# EasyEDA Pro project ProPrj_SlimeVR_RelicSkin（fork from SK）.epro, board Relic_BNO085
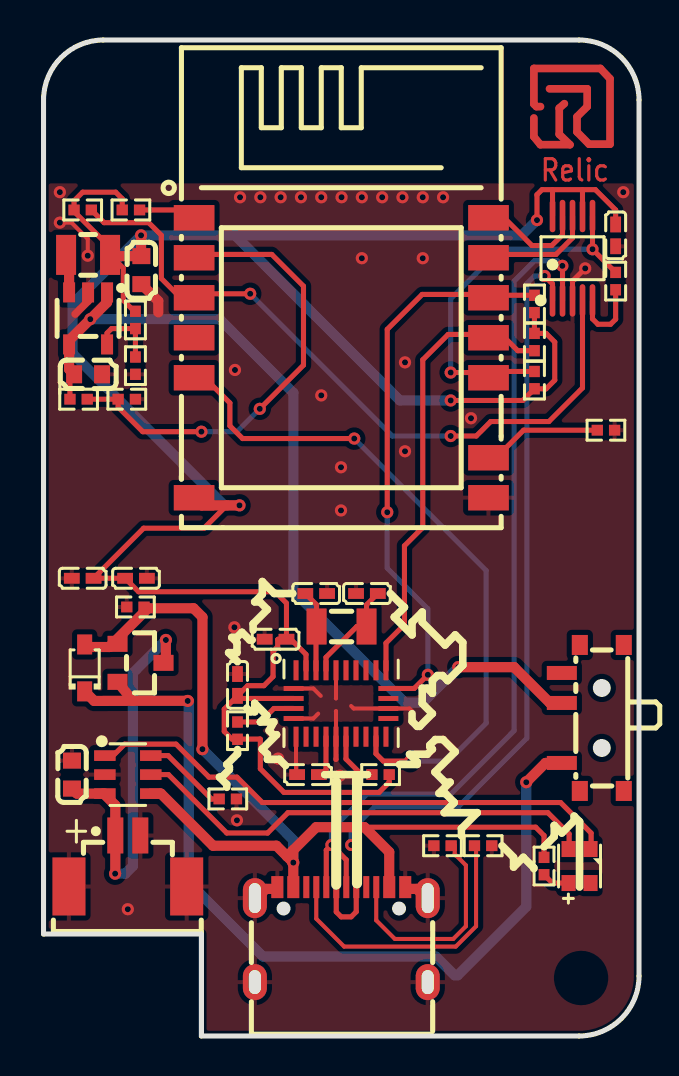
[diagram p7: board, top side]
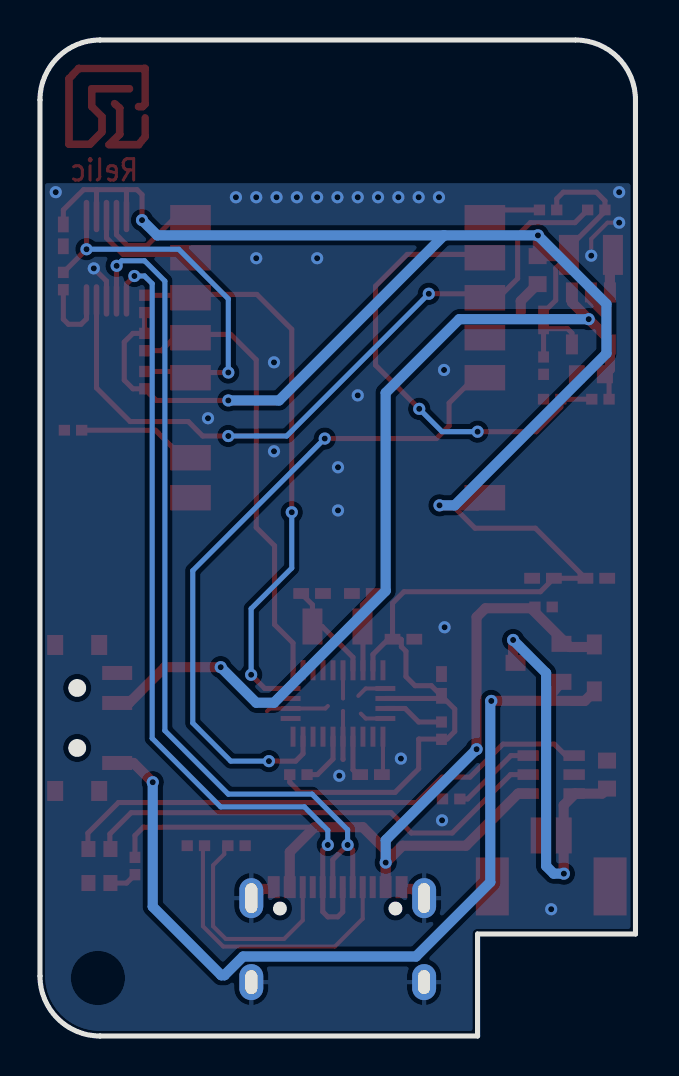
[diagram p8: board, bottom side, seen from below]

Outline 29.8 x 49.8 mm; copper layers: Top Layer, Bottom Layer. Coordinates in mm from the lower left corner of the outline.
Outline path: 0,46.8 arc(0.88,48.92) 3,49.8 26.8,49.8 arc(28.92,48.92) 29.8,46.8 29.8,3 arc(28.92,0.88) 26.8,0 7.9,0 7.9,5.1 0,5.1 0,46.8
Stack: Top Layer 0.035mm / Dielectric1 0.91mm FR4 er 4.5 / Bottom Layer 0.035mm

## Design rules (mm)
spacing Default (default): track to track 0.127, other pairs 0 to 0.127
track width Default (default): min 0.127, default 0.127, max 25.4
differential pair differentialPair (default): width min 0.127, default 0.254, max 2.54; gap min 0.152, default 0.152
via Default (default): diameter min 0.61, default 0.61, max 100.025; hole min 0.305, default 0.305, max 59.995
net GND uses gge20888(1)

## Placement (name value [footprint] x y rotation side)
BNO085  BNO080  [bno080]  14.89 16.63 90 top
C1  1uF  [C0402]  1.96 22.89 0 top
C2  100nF  [C0402]  4.63 22.89 180 top
C3  100nF  [C0402]  28.63 40.03 90 top
C4  10uF  [C0603]  2.23 33.09 180 top
C5  10uF  [C0603]  4.9 38.29 90 top
C6  22pF  [C0402]  13.64 22.12 180 top
C7  22pF  [C0402]  16.18 22.12 0 top
C8  100nF  [C0402]  13.24 13.07 180 top
C9  100nF  [C0402]  9.71 17.55 270 top
C10  100nF  [C0402]  11.61 19.84 0 top
CN1  1.25-2PWB  [conn-smd_2p-p1.25_dealon_1.25-2pwb]  4.22 8.75 0 top
CP1  10uF  [C0603]  1.42 13.07 270 top
D1  1N5819WS  [SOD-323_L1.8-W1.3-LS2.5-RD]  2.06 18.4 90 top
ESP1  2.4GHz  [wifim-smd_esp-12f-esp8266mod]  14.9 33.26 270 top
FB1  22kΩ  [R0402]  4.6 33.52 90 top
FB2  100kΩ  [R0402]  4.6 35.8 90 top
L1  2.2uH  [IND-SMD_L2.5-W2.0_YXMBL252010P]  2.23 39.06 180 top
LED1  NH-B2020RGBA-HF  [LED-ARRAY-SMD_4P-L2.1-W2.1-TL_NH-B2020RGBA]  26.82 8.5 270 top
P1  TP4057-42-SOT26-R  [SOT-23-6_L2.9-W1.6-P0.95-LS2.8-BL]  4.22 13.07 270 top
Q1  AO3401A  [SOT-23_L2.9-W1.3-P1.90-LS2.4-BR]  4.85 18.66 180 top
R1  4.7kΩ  [R0402]  1.96 41.3 0 top
R2  4.7kΩ  [R0402]  4.37 41.3 0 top
R3  4.7kΩ  [R0402]  24.57 32.79 90 top
R4  4.7kΩ  [R0402]  24.57 34.7 270 top
R5  4.7kΩ  [R0402]  24.57 36.6 90 top
R6  10kΩ  [R0402]  9.71 15.27 90 top
R7  4.7kΩ  [R0402]  16.87 13.07 0 top
R8  4.7kΩ  [R0402]  28.63 37.75 270 top
R9  10kΩ  [R0402]  4.6 21.45 0 top
RA1  2kΩ  [R0402]  9.22 11.85 0 top
RD1  5.1kΩ  [R0402]  22 9.51 180 top
RD2  5.1kΩ  [R0402]  19.97 9.51 0 top
RD3  4.7kΩ  [R0402]  28.15 30.29 180 top
RL1  1kΩ  [R0402]  25.05 8.5 90 top
SW1  SSSS811101  [SW-SMD_SSSS811101]  27.49 15.9 90 top
U1  M3406-ADJ  [SOT-23-5_L3.0-W1.7-P0.95-LS2.8-BR]  2.23 35.88 90 top
UART1  CH340X  [MSOP-10_L3.0-W3.0-P0.50-LS5.0-BL]  26.47 38.89 0 top
USB1  TYPE-C 16PIN 2MD(073)  [USB-C-SMD_TYPE-C-6PIN-2MD-073]  14.9 5.07 0 top
VDG  10kΩ  [R0402]  4.17 31.84 180 top
VDV  47kΩ  [R0402]  1.75 31.84 180 top
X1  32.768kHz  [FC-135R_L3.2-W1.5]  14.91 20.47 0 top

## Footprints (pads in the part's own frame, mm; a bottom-side part is the same pattern mirrored in y, then rotated)
bno080
  rect 1x0.25 smd: 1(1.66,2.25) 6(-1.66,2.251) 7(-1.66,1.75) 8(-1.66,1.25) 9(-1.66,0.75) 10(-1.66,0.25) 11(-1.66,-0.25) 12(-1.66,-0.75) 13(-1.66,-1.25) 14(-1.66,-1.75) 15(-1.66,-2.251) 20(1.66,-2.251) 21(1.66,-1.75) 22(1.66,-1.25) 23(1.66,-0.75) 24(1.66,-0.251) 25(1.66,0.25) 26(1.66,0.75) 27(1.66,1.25) 28(1.66,1.75)
  rect 0.25x1 smd: 2(0.75,2.369) 3(0.251,2.369) 4(-0.251,2.369) 5(-0.75,2.369) 16(-0.75,-2.37) 17(-0.25,-2.37) 18(0.25,-2.37) 19(0.75,-2.37)
C0402
  rect 0.79x0.54 smd: 1(-0.545,0) 2(0.545,0)
C0603
  rect 0.8x0.9 smd: 1(-0.7,0) 2(0.7,0)
conn-smd_2p-p1.25_dealon_1.25-2pwb
  rect 0.8x1.8 smd: 1(-0.625,1.275) 2(0.625,1.275)
  rect 1.651x2.9 smd: 3(-2.946,-1.275) 4(2.946,-1.275)
FC-135R_L3.2-W1.5
  rect 1x1.8 smd: 1(-1.25,0) 2(1.25,0)
IND-SMD_L2.5-W2.0_YXMBL252010P
  rect 1x2 smd: 1(1.1,0) 2(-1.1,0)
LED-ARRAY-SMD_4P-L2.1-W2.1-TL_NH-B2020RGBA
  rect 0.8x0.7 smd: 1(-0.85,0.55) 2(0.85,0.55) 3(0.85,-0.55) 4(-0.85,-0.55)
MSOP-10_L3.0-W3.0-P0.50-LS5.0-BL
  oval 0.28x1.62 smd: 1(-1,-2.11) 2(-0.5,-2.11) 3(0,-2.11) 4(0.5,-2.11) 5(1,-2.11) 6(1,2.11) 7(0.5,2.11) 8(0,2.11) 9(-0.5,2.11) 10(-1,2.11)
R0402
  rect 0.566x0.54 smd: 1(-0.433,0) 2(0.433,0)
SOD-323_L1.8-W1.3-LS2.5-RD
  rect 1x0.75 smd: 1(-1.173,0) 2(1.173,0)
SOT-23-5_L3.0-W1.7-P0.95-LS2.8-BR
  rect 1x0.6 smd: 1(1.3,-0.95) 2(1.3,0) 3(1.3,0.95) 4(-1.3,0.95) 5(-1.3,-0.95)
SOT-23-6_L2.9-W1.6-P0.95-LS2.8-BL
  rect 0.532x1.072 smd: 1(-0.95,-1.149) 2(0,-1.149) 3(0.95,-1.149) 4(0.95,1.149) 5(0,1.149) 6(-0.95,1.149)
SOT-23_L2.9-W1.3-P1.90-LS2.4-BR
  rect 1x0.8 smd: 1(1.15,-0.95) 2(1.15,0.95) 3(-1.15,0)
SW-SMD_SSSS811101
  rect 0.7x1.5 smd: 1(-2.25,1.55) 2(0.75,1.55) 3(2.25,1.55)
  rect 1x0.8 smd: 4(-3.65,0.65) 5(3.65,0.65) 6(3.65,-1.55) 7(-3.65,-1.55)
USB-C-SMD_TYPE-C-6PIN-2MD-073
  rect 0.6x1.1 smd: 1(-3.2,2.375) 2(-2.4,2.375) 11(2.4,2.375) 12(3.2,2.375)
  rect 0.3x1.1 smd: 3(-1.75,2.375) 4(-1.25,2.375) 5(-0.75,2.375) 6(-0.25,2.375) 7(0.25,2.375) 8(0.75,2.375) 9(1.25,2.375) 10(1.75,2.375)
  oval 1.2x2 hole 0.6x1.5: 13(-4.325,1.825) 14(4.325,1.825)
  oval 1.2x1.8 hole 0.6x1.2: 15(-4.325,-2.375) 16(4.325,-2.375)
wifim-smd_esp-12f-esp8266mod
  rect 1.27x2.032 smd: 1(-7.651,-7.366) 2(-5.651,-7.366) 3(-3.651,-7.366) 4(-1.651,-7.366) 5(0.349,-7.366) 8(6.349,-7.366) 9(6.349,7.366) 10(4.349,7.366) 12(0.349,7.366) 13(-1.651,7.366) 14(-3.651,7.366) 15(-5.651,7.366) 16(-7.651,7.366)

## Nets
3V3: BNO085.3 BNO085.28 C1.2 C2.2 C3.2 C5.2 C9.2 C10.2 ESP1.8 FB2.2 L1.2 R1.1 R2.1 R3.1 R4.1 R5.1 R6.1 R7.2 UART1.7 UART1.10
+5V: D1.2 P1.4 Q1.1 R9.2 RL1.2 USB1.2 USB1.11
GND: BNO085.2 BNO085.5 BNO085.6 BNO085.10 BNO085.17 BNO085.25 C1.1 C2.1 C3.1 C4.1 C5.1 C6.1 C7.1 C8.2 C9.1 C10.1 CN1.2 CN1.3 CN1.4 CP1.1 ESP1.9 FB1.1 P1.2 R9.1 RA1.2 RD1.1 RD2.1 RD3.1 U1.2 UART1.3 USB1.1 USB1.12 USB1.13 USB1.14 USB1.15 USB1.16 VDG.1
VIN: C4.2 SW1.2 U1.1 U1.4 VDV.2
ADC: ESP1.2 VDG.2 VDV.1
BAT+: CN1.1 CP1.2 P1.3 Q1.3
DN: UART1.2 USB1.5 USB1.7
DP: UART1.1 USB1.6 USB1.8
EN: ESP1.3 R1.2 UART1.4
G: LED1.4 P1.5
GPIO0: ESP1.12 R3.2 R8.1 UART1.6
GPIO15: ESP1.10 RD3.2
INT: BNO085.14 ESP1.5
R: LED1.1 P1.1
RST: ESP1.1 R2.2
RX: ESP1.15 UART1.8
SCL: BNO085.19 ESP1.14 R5.2
SDA: BNO085.20 ESP1.13 R4.2
TX: ESP1.16 UART1.9
VOUT: D1.1 Q1.2 SW1.1
$1N6016: RD1.2 USB1.4
$1N6017: RD2.2 USB1.10
$1N6024: P1.6 RA1.1
$1N11317: BNO085.27 C6.2 X1.1
$1N11318: BNO085.26 C7.2 X1.2
$1N11320: BNO085.9 C8.1
$1N11326: BNO085.4 R6.2
$1N11328: BNO085.11 R7.1
$1N28912: R8.2 UART1.5
$1N31333: L1.1 U1.3
$1N31339: FB1.2 FB2.1 U1.5
$1N32922: LED1.3 RL1.1

Pads without a net: BNO085 1 7 8 12 13 15 16 18 21 22 23 24; ESP1 4; LED1 2; SW1 3 4 5 6 7; USB1 3 9

## Via types
v1: diameter 0.61, hole 0.305, Top Layer to Bottom Layer, 56 vias

## Routing (per net, layer and track width the routed paths; a pad name or vN(x,y) marks a point on that pad's centre or on a via; arc(x,y) is an arc through that point)
3V3: length 129.9
  Top Layer w0.254: C9.2 9.04,16.34 9.04,15.23 9.43,14.85 10.84,14.85 10.85,14.83 10.85,13.36 12.03,12.18 16.79,12.18 17.3,12.69 R7.2 ; C9.2 9.84,16.88 BNO085.3 ; C9.2 10.21,17.52 11.03,17.52 11.49,17.97 11.49,19.23 11.72,19.46 11.72,19.82 11.74,19.84 C10.2 ; UART1.10 25.47,42.32 ; C3.2 28.63,41.3 27.61,42.32 24.95,42.32 24.69,42.06 v1(24.69,40.79) ; L1.2 3.33,39.42 1.53,41.23 R1.1 1.53,41.76 1.96,42.19 3.61,42.19 3.94,41.86 R2.1 ; C10.2 12.37,19.84 13.14,19.08 BNO085.28 ; C10.2 12.16,21.64 11.58,22.21 4.75,22.21 C2.2 C1.2 5.01,25.39 8.03,25.39 9.17,26.53 ; 3.39,38.99 3.99,38.39 3.99,36.78 4.63,36.15 ; v1(20.38,31.78) 23.98,31.78 R3.1 25.15,32.36 25.58,32.79 25.58,34.7 25.15,35.13 R4.1 R5.1 ; UART1.7 26.97,42.32
  Top Layer w0.508: v1(4.88,40.03) 4.88,39.01 C5.2 3.39,38.99 L1.2 ; ESP1.8 7.92,26.53 v1(9.81,26.53)
  Bottom Layer w0.508: 9.58,40.03 17.84,31.78 v1(20.38,31.78) ; 9.58,40.03 v1(4.88,40.03) 1.45,36.6 1.45,34.12 9.04,26.53 v1(9.81,26.53) ; 9.58,40.03 23.93,40.03 v1(24.69,40.79)
+5V: length 49.9
  Top Layer w0.254: 16.06,10.44 24.63,10.44 25.05,10.02 RL1.2
  Top Layer w0.508: 12.5,9.3 12.19,8.98 ; 12.5,9.3 13.64,10.44 16.06,10.44 17.3,9.2 17.3,7.36 ; 12.5,9.3 v1(12.5,8.67) ; 12.19,8.98 v1(12.5,8.67) ; 12.19,8.98 11.66,9.51 8.48,9.51 5.88,12.12 P1.4 ; v1(12.5,8.67) 12.5,7.36 ; v1(7.95,14.34) 7.95,20.94 7.51,21.39 5.23,21.39 3.29,19.45 2.19,19.45 D1.2
  Bottom Layer w0.508: v1(7.95,14.34) 12.5,9.79 v1(12.5,8.67)
GND: length 22
  Top Layer w0.203: 18.44,16.25 18.31,16.38 BNO085.17 15.52,16.38 15.39,16.5 ; 13.74,16.12 13.5,15.88 BNO085.5 ; BNO085.25 14.64,16.88 14.63,16.88 ; 14.63,16.25 14.64,16.24 BNO085.10 ; BNO085.2 13.5,17.38 13.87,17.01 ; v1(2.21,39.02) 2.21,39.85 1.4,40.67 v1(0.82,40.67) ; C8.2 12.64,13.12 BNO085.6
  Top Layer w0.254: v1(27.11,38.38) 26.47,37.75 UART1.3 ; 14.63,13.83 14.64,13.84 BNO085.10
  Top Layer w0.381: 1.58,36.09 2.23,36.75 U1.2
  Top Layer w0.508: 19.22,6.81 18.67,7.36 18.1,7.36 ; 11.7,7.36 11.12,7.36 10.57,6.81 ; C5.1 5.74,36.75 5.74,36.18
  vias: v1(0.82,42.19) v1(4.22,6.34) v1(9.58,33.3) v1(9.55,20.44) v1(9.68,10.78) v1(9.83,41.94) v1(10.85,41.94) v1(11.74,13.87) v1(11.87,41.94) v1(12.88,41.94) v1(13.9,41.94) v1(13.9,32.03) v1(14.82,13.01) v1(14.91,41.94) v1(14.89,28.44) v1(14.89,26.28) v1(15.93,41.94) v1(15.93,38.89) v1(16.95,41.94) v1(17.96,41.94) v1(18.09,33.68) v1(18.09,29.24) v1(18.98,41.94) v1(18.98,38.89) v1(19.99,41.94) v1(21.39,30.89) v1(29.01,42.19)
VIN: length 45.1
  Top Layer w0.254: VDV.2 1.32,32.88 C4.2
  Top Layer w0.508: SW1.2 25.34,16.65 23.55,18.44 v1(20.76,18.44) ; U1.1 3.18,36.68 v1(2.34,35.84) 1.28,34.78 U1.4 1.28,33.34 C4.2
  Bottom Layer w0.508: v1(20.76,18.44) 18.98,16.66 18.09,16.66 12.5,22.25 12.5,32.16 8.82,35.84 v1(2.34,35.84)
ADC: length 23.4
  Top Layer w0.254: v1(7.9,30.22) 4.96,30.22 3.73,31.44 VDG.2 VDV.1 ; v1(10.82,31.36) 13.01,33.55 13.01,37.49 11.42,39.08 7.35,39.08
  Bottom Layer w0.254: v1(7.9,30.22) 9.68,30.22 v1(10.82,31.36)
BAT+: length 20.2
  Top Layer w0.508: 3.01,12.12 3.59,11.54 CN1.1 3.59,8.13 v1(3.58,8.12) ; 3.01,12.12 P1.3 ; 3.01,12.12 1.67,12.12 CP1.2 ; Q1.3 6.12,18.78 v1(6.12,19.8)
  Bottom Layer w0.508: v1(3.58,8.12) 4.09,8.12 4.47,8.5 4.47,18.15 v1(6.12,19.8)
DN: length 43.9
  Top Layer w0.254: 14.15,7.36 14.15,9.29 v1(14.41,9.55) 15.15,8.81 15.15,7.36 ; v1(25.96,38.51) 25.97,38.5 UART1.2
  Bottom Layer w0.254: v1(14.41,9.55) 14.41,10.31 16.18,12.09 20.38,12.09 23.55,15.27 23.55,37.75 24.57,38.76 25.71,38.76 v1(25.96,38.51)
DP: length 42.4
  Top Layer w0.254: 14.65,7.36 14.65,6.21 14.9,5.96 15.39,5.96 15.65,6.21 15.65,9.3 v1(15.4,9.55) ; UART1.1 25.47,37.6 v1(25.07,38)
  Bottom Layer w0.254: v1(15.4,9.55) 15.4,10.29 16.56,11.46 20.76,11.46 24.19,14.89 24.19,37.62 24.57,38 v1(25.07,38)
EN: length 35.9
  Top Layer w0.254: v1(20.38,30) 21.66,30 22.38,30.72 25.29,30.72 26.97,32.4 UART1.4 ; v1(10.34,37.11) 7.38,37.11 7.35,37.08 6.69,37.08 5.9,37.87 5.9,40.03 5.26,40.67 3.03,40.67 R1.2
  Bottom Layer w0.254: v1(20.38,30) 17.45,30 v1(10.34,37.11)
G: length 23.7
  Top Layer w0.254: P1.5 6.25,13.07 9.17,10.15 11.21,10.15 12.23,11.17 25.24,11.17 26.3,10.1 26.3,9.39
GPIO0: length 19.4
  Top Layer w0.254: R8.1 v1(27.47,39.34) UART1.6 ; R3.2 22.6,33.23 22.45,33.08 22.36,33.17 v1(20.38,33.17)
  Bottom Layer w0.254: v1(27.47,39.34) 22.86,39.34 20.38,36.86 v1(20.38,33.17)
GPIO15: length 5.9
  Top Layer w0.254: 27.84,30.29 24.02,30.29 22.84,29.11 22.48,29.11 22.45,29.08
INT: length 34.5
  Top Layer w0.254: BNO085.14 16.64,14.11 17.01,13.74 v1(18.34,13.74) ; 7.35,33.08 7.9,33.08 9.33,31.65 9.33,30.51 9.96,29.87 v1(15.55,29.87)
  Bottom Layer w0.254: v1(18.34,13.74) 20.25,13.74 22.15,15.65 22.15,23.27 v1(15.55,29.87)
R: length 26.8
  Top Layer w0.254: 3.49,14.02 4.06,14.59 6.63,14.59 8.28,12.94 9.68,12.94 10.95,11.67 25.87,11.67 27.4,10.15 27.4,9.39
RST: length 2.6
  Top Layer w0.254: 7.35,41.08 7.12,41.3 R2.2
RX: length 5.5
  Top Layer w0.254: 22.45,39.08 25.64,39.08 26.47,39.91 UART1.8
SCL: length 28.5
  Top Layer w0.254: R5.2 22.49,37.04 22.45,37.08 18.95,37.08 17.2,35.33 v1(17.2,26.19) ; BNO085.19 18.55,17.38 v1(19.23,18.06)
  Bottom Layer w0.254: v1(19.23,18.06) 19.23,21.36 17.2,23.4 v1(17.2,26.19)
SDA: length 22.7
  Top Layer w0.254: R4.2 23.73,34.27 22.92,35.08 20.25,35.08 18.98,33.81 18.98,25.43 18.06,24.51 18.06,20.57 17.14,19.65 BNO085.20
TX: length 5.3
  Top Layer w0.254: 22.45,41.08 22.88,41.08 24.44,39.52 25.43,39.52 25.97,40.06 UART1.9
VOUT: length 44.3
  Top Layer w0.508: Q1.2 4.47,16.76 ; 4.47,16.76 7.27,16.76 ; 4.47,16.76 2.54,16.75 D1.1 ; SW1.1 25.12,13.65 v1(24.16,12.69)
  Bottom Layer w0.508: 7.27,16.75 7.27,7.69 10.98,3.98 19.63,3.98 20.57,3.04 20.73,3.04 24.16,6.47 v1(24.16,12.69)
  vias: v1(7.22,16.75)
$1N6016: length 14.6
  Top Layer w0.203: 21.59,9.55 21.65,9.5 21.65,5.49 20.63,4.47 15.04,4.47 13.65,5.86 13.65,7.36
$1N6017: length 11
  Top Layer w0.203: 20.58,9.55 20.58,9.1 21.14,8.54 21.14,5.49 20.5,4.85 17.58,4.85 16.65,5.79 16.65,7.36
$1N6024: length 4.3
  Top Layer w0.254: RA1.1 8.4,11.85 6.23,14.02 P1.6
$1N11317: length 4.1
  Top Layer w0.254: BNO085.27 13.64,20.45 X1.1 13.66,21.56 C6.2
$1N11318: length 5.2
  Top Layer w0.254: C7.2 16.16,21.56 X1.2 15.68,20.47 14.14,18.93 BNO085.26
$1N11320: length 1.9
  Top Layer w0.254: BNO085.9 14.14,13.31 13.94,13.11
$1N11326: length 3.1
  Top Layer w0.254: R6.2 10.85,15.7 11.53,16.38 BNO085.4
$1N11328: length 2.7
  Top Layer w0.254: R7.1 15.92,13.07 15.14,13.85 BNO085.11
$1N28912: length 3.8
  Top Layer w0.254: R8.2 28.63,35.84 28.38,35.59 27.74,35.59 27.47,35.86 UART1.5
$1N31333: length 1.9
  Top Layer w0.508: U1.3 1.28,38.91 L1.1
$1N31339: length 3.5
  Top Layer w0.254: FB1.2 FB2.1 3.4,35.37 3.18,35.15 U1.5
$1N32922: length 1.4
  Top Layer w0.254: RL1.1 25.46,7.65 LED1.3

## Copper pours and planes (outline as drawn; the poured copper is in the pictures)
GND on Top Layer: -2.64,54.34 31.02,54.34 31.02,-12.84 -2.64,-12.84
GND on Bottom Layer: -8.86,53.84 30.38,53.84 30.38,-0.52 -8.86,-0.52
GND on Bottom Layer: -2.77,54.22 32.79,54.22 32.79,-1.53 -2.77,-1.53

## Text on the board
Document Layer: Y | TP4057:2K | DEG_0
Top Layer: Relic
Top Solder Mask Layer: 400mA | 5V | ... | Relic | SECURE YOUR SOUL | -
Top Silkscreen Layer: +
